# Altium schematic sheet PowerSupply.SchDoc
size A4
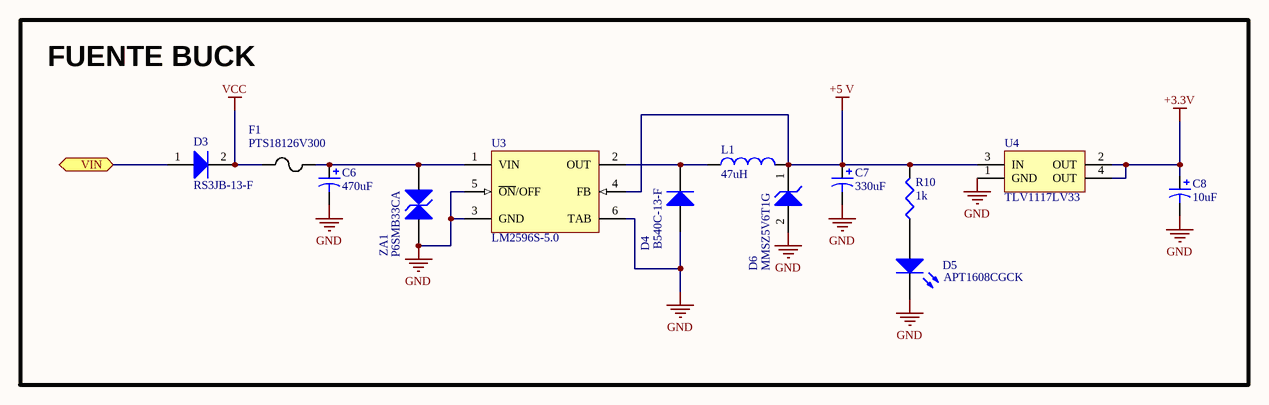
[diagram p0: PowerSupply.SchDoc]

## Parts
C6  470uF  [CapElecSMD_10mm]
C7  330uF  [CapElecSMD_8mm]
C8  10uF  [CAPC3225N]
D3  RS3JB-13-F  [SMB]
D4  B540C-13-F  [SMC]
D5  APT1608CGCK  [ChipDiode1608]
D6  MMSZ5V6T1G  [SOD-123_ONS-M]
F1  PTS18126V300  [FUSE_PTS18126_COB]
L1  47uH  [INDUCTOR_47UH_3A]
R10  1k  [RESC2012N]
U3  LM2596S-5.0  [LM2596S-5.0]
U4  TLV1117LV33  [SOT223]
ZA1  P6SMB33CA  [SMB]

## Blocks framed on the sheet
FUENTE BUCK: C6-C8 D3-D6 F1 L1 R10 U3 U4 ZA1

## Ports
VIN

## Nets
+3.3V: C8.1 U4.2(OUT) U4.4(OUT)
+5 V: C7.1 D6.1(K) L1.2 R10.2 U3.4(FB) U4.3(IN)
GND: C6.2 C7.2 C8.2 D4.1(A) D5.2(K) D6.2(A) U3.3(GND) U3.5(~{ON}/OFF) U3.6(TAB) U4.1(GND) ZA1.2
VCC: D3.2(K) F1.1
VIN: D3.1(A) ; port VIN
NetC6_1: C6.1 F1.2 U3.1(VIN) ZA1.1
NetD4_2: D4.2(K) L1.1 U3.2(OUT)
NetD5_1: D5.1(A) R10.1

## Library data of the parts
C6-C8 = Cap Pol3: Polarized Capacitor (Surface Mount); Published: 8-Jun-2000; LatestRevisionDate: 29-May-2009; LatestRevisionNote: IPC-7351 Footprint Added.; PackageReference: C0805; Publisher: Altium Limited; PackageDescription: Chip Capacitor
  C6: Value: 470uF
  C7: Value: 330uF
  C8: Value: 10uF
D3 D4 = Diode: Default Diode; Published: 8-Jun-2000; LatestRevisionDate: 17-Jul-2002; LatestRevisionNote: Re-released for DXP Platform.; PackageVersion: Sep-1996; PackageReference: SMC; Publisher: Altium Limited; PackageDescription: DO-214-AB/SMC; 2 C-Bend Leads; Body 7.9 x 5.9 mm, inc. leads (LxW); Code_JEDEC: DO-214-AB
D5 = LED2: LED 1.6x0.8 mm 570 nm GRN CLR SMD; Published: 8-Jun-2000; LatestRevisionDate: 17-Jul-2002; LatestRevisionNote: Re-released for DXP Platform.; PackageVersion: Feb-2002; PackageReference: 3.2X1.6X1.1; Publisher: Altium Limited; PackageDescription: SM LED; 2 Flat Leads
D6 = D Zener: Zener Diode; Published: 8-Jun-2000; LatestRevisionDate: 17-Jul-2002; LatestRevisionNote: Re-released for DXP Platform.; PackageReference: DIODE-0.7; Publisher: Altium Limited; PackageDescription: Diode, Thru-Hole; 2 Leads; 0.7 in Pin Spacing
F1 = PTS18126V300: PTC RESET FUSE 6V 3A 1812; Mfr_Name: Eaton
L1 = Inductor: Code_IEC: 1005; Published: 8-Jun-2000; LatestRevisionDate: 29-May-2009; LatestRevisionNote: IPC-7351 Footprint Added.; PackageReference: 0402-A; Publisher: Altium Limited; PackageDescription: Chip Inductor; Code_JEITA: 0402; Value: 47uH
R10 = Res3: Resistor; Published: 8-Jun-2000; LatestRevisionDate: 29-May-2009; LatestRevisionNote: IPC-7351 Footprint Added.; PackageReference: J1-0603; Publisher: Altium Limited; PackageDescription: Chip Resistor; Value: 1K
U3 = LM2596S-5.0: IC REG BUCK 5V 3A TO263-5L
U4 = TLV1117LV33: 1-A, Positive Fixed Voltage, Low-Dropout Regulator
ZA1 = TVS Diode: Transient voltage suppressor diode